# Altium schematic sheet System.SchDoc
size A4
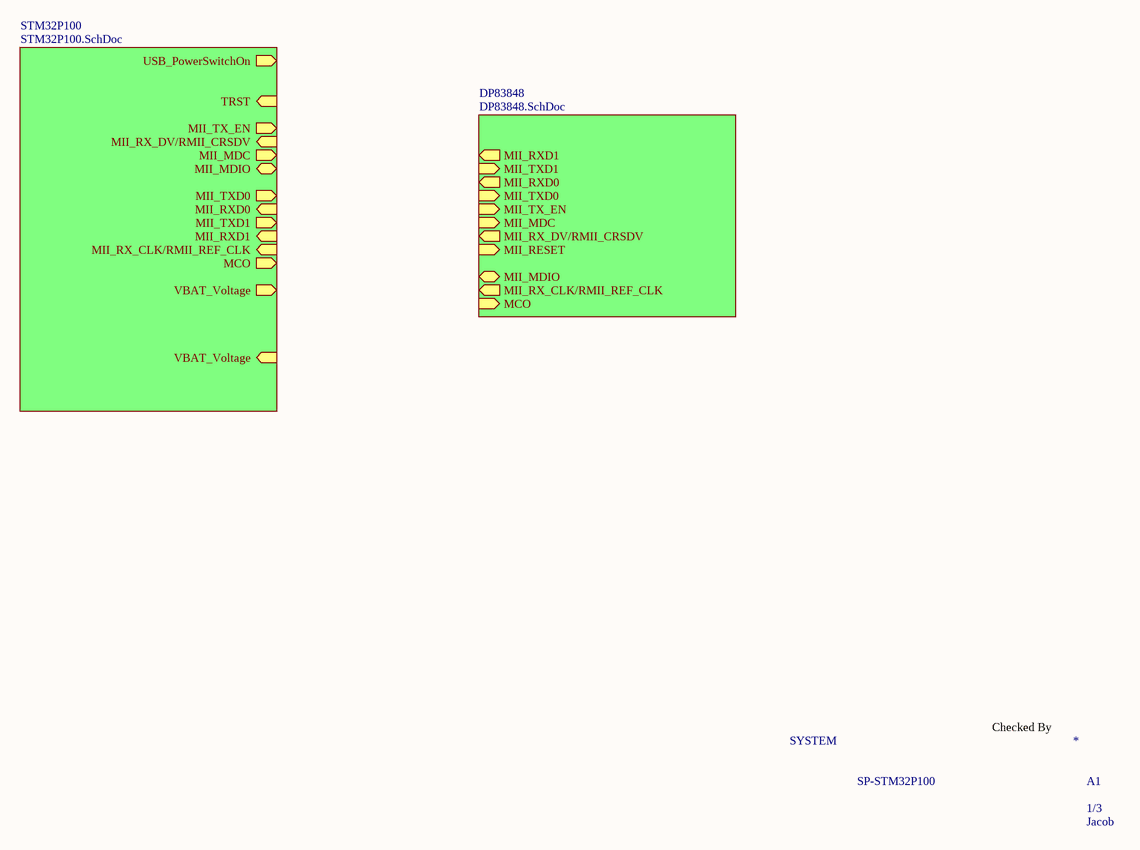
[diagram p0: System.SchDoc]

## Sub-sheets
DP83848 = DP83848.SchDoc: MII_RXD1 (out), MII_TXD1 (in), MII_RXD0 (out), MII_TXD0 (in), MII_TX_EN (in), MII_MDC (in), MII_RX_DV/RMII_CRSDV (out), MII_RESET (in), MII_MDIO (bidir), MII_RX_CLK/RMII_REF_CLK (out), MCO (in)
STM32P100 = STM32P100.SchDoc: USB_PowerSwitchOn (out), MII_TX_EN (out), MII_RX_DV/RMII_CRSDV (in), MII_MDC (out), MII_MDIO (bidir), TRST (in), MII_TXD0 (out), MII_RXD0 (in), MII_TXD1 (out), MII_RXD1 (in), MII_RX_CLK/RMII_REF_CLK (in), MCO (out), VBAT_Voltage (out), VBAT_Voltage (in)

## Notes on the sheet
- SYSTEM
- Checked By
- *
- SP-STM32P100
- A1
- 1/3
- Jacob